# Altium schematic sheet PS_3_PMIC.SchDoc
size A3; SheetNumber: 18; SheetTotal: 19
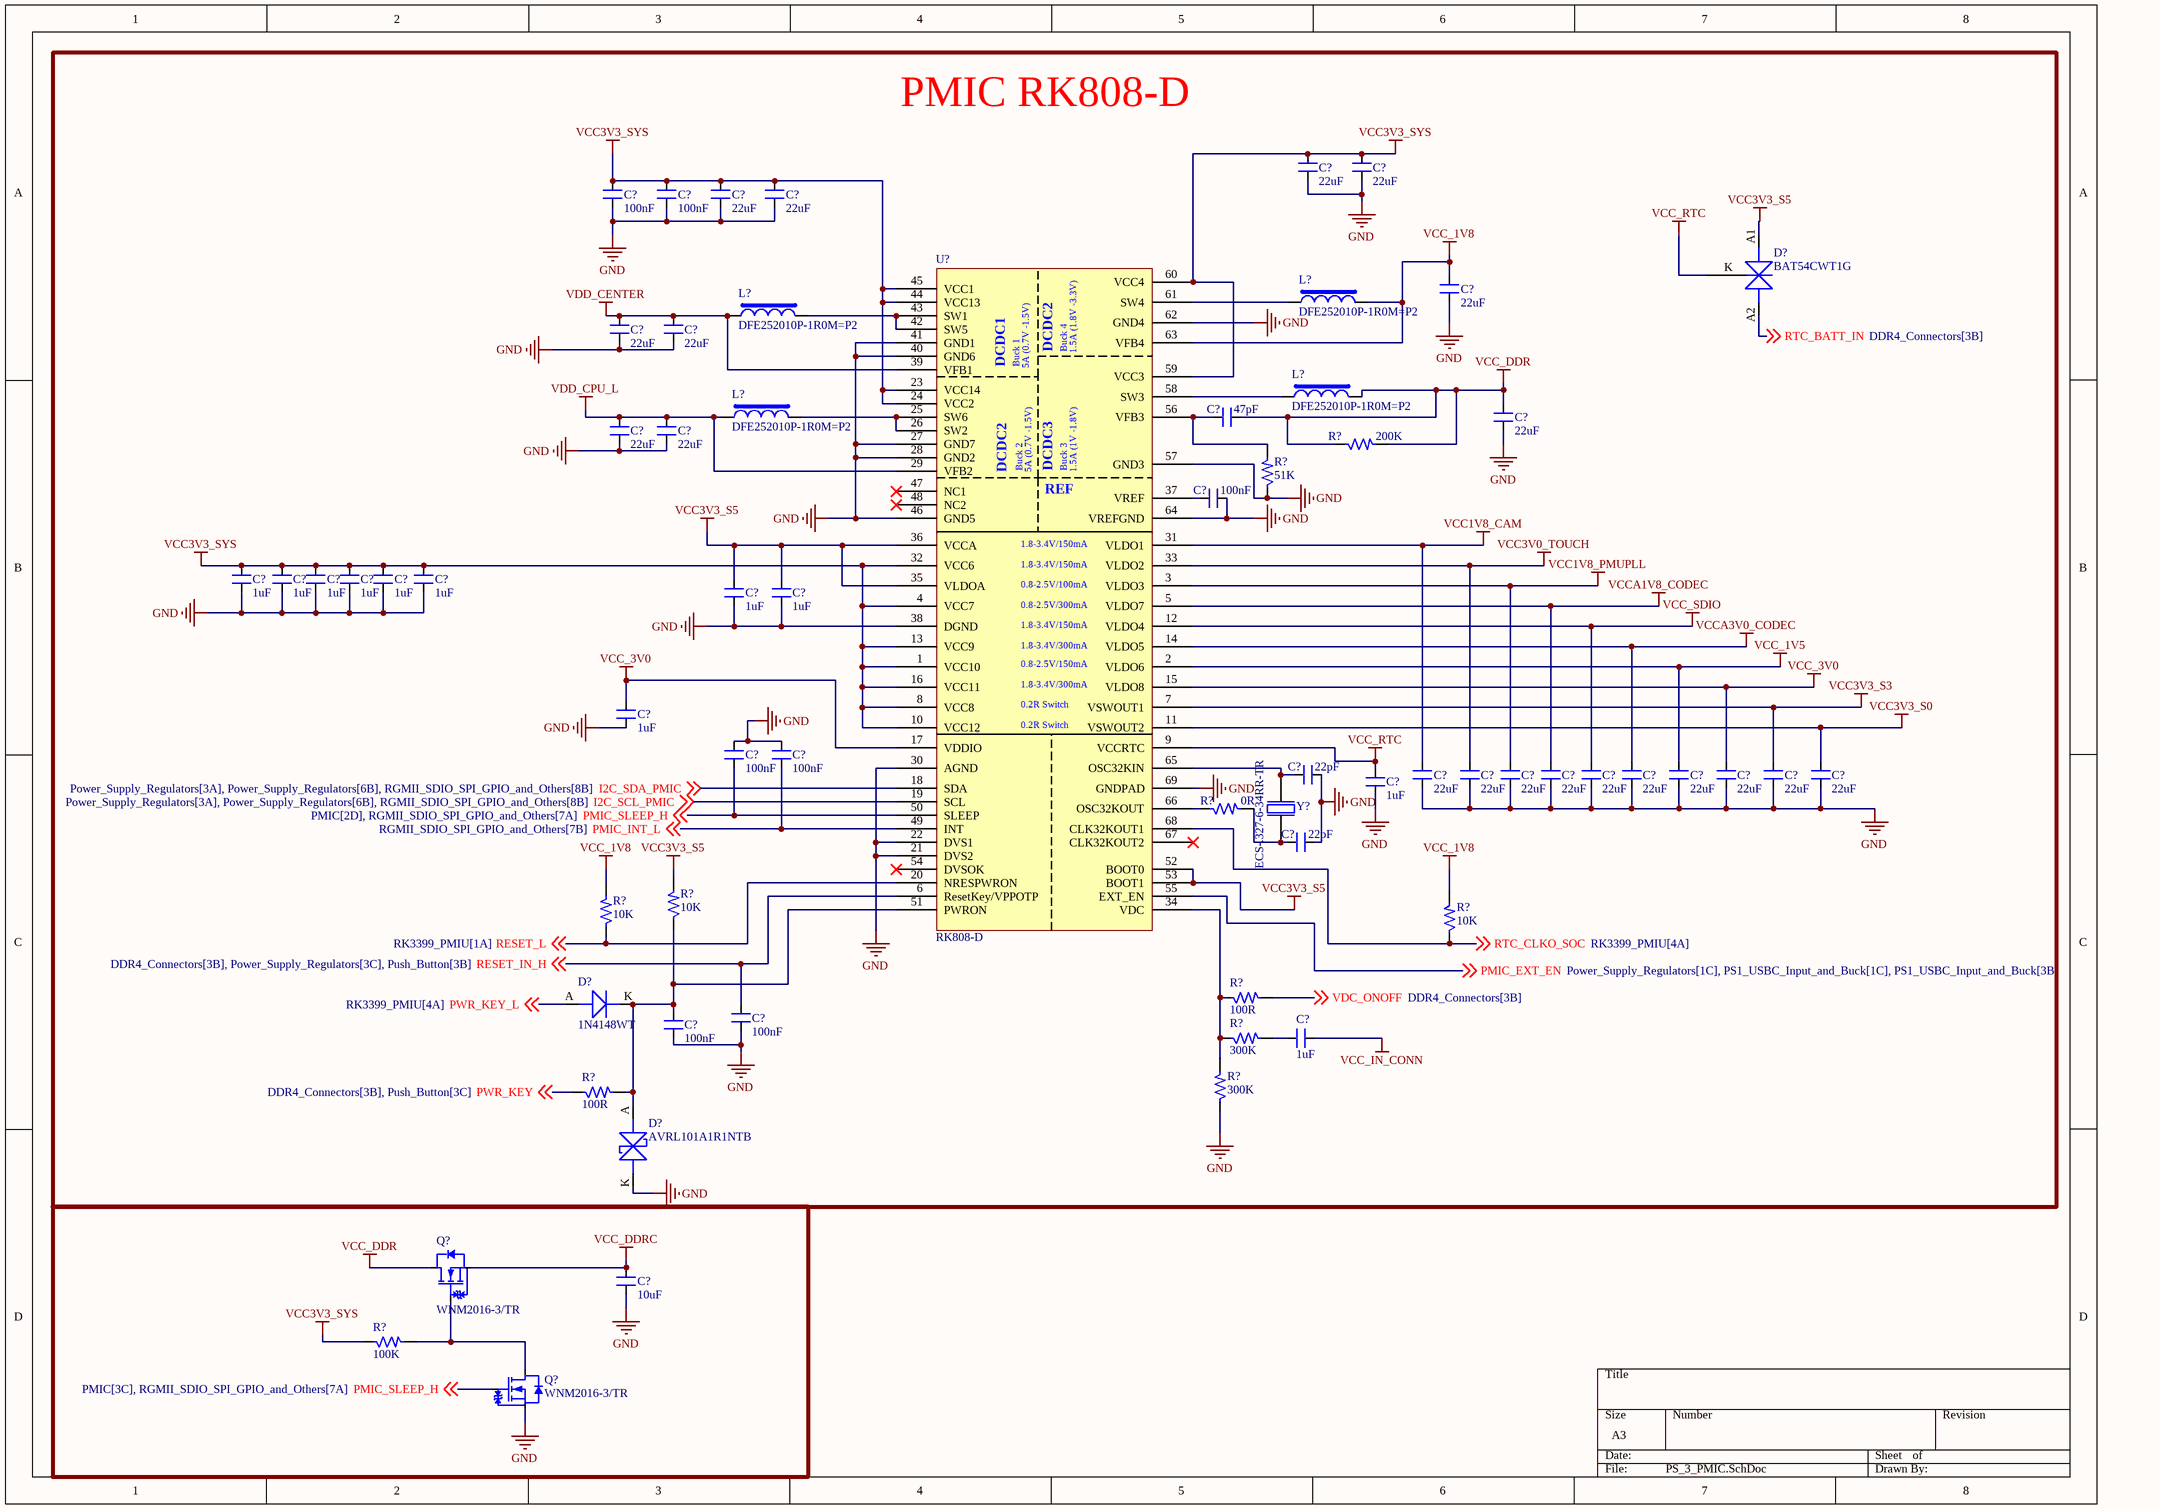
[diagram p0: PS_3_PMIC.SchDoc]

## Parts
(Parts that share a designator on the sheet are numbered #1, #2 ... from top to bottom, then left to right.)
C?#1  22uF  [CAP_0603]
C?#2  22uF  [CAP_0603]
C?#3  100nF  [CAP_0402]
C?#4  100nF  [CAP_0402]
C?#5  22uF  [CAP_0603]
C?#6  22uF  [CAP_0603]
C?#7  22uF  [CAP_0603]
C?#8  22uF  [CAP_0603]
C?#9  22uF  [CAP_0603]
C?#10  47pF  [CAP_0402]
C?#11  22uF  [CAP_0603]
C?#12  22uF  [CAP_0603]
C?#13  22uF  [CAP_0603]
C?#14  100nF  [CAP_0402]
C?#15  1uF  [CAP_0402]
C?#16  1uF  [CAP_0402]
C?#17  1uF  [CAP_0402]
C?#18  1uF  [CAP_0402]
C?#19  1uF  [CAP_0402]
C?#20  1uF  [CAP_0402]
C?#21  1uF  [CAP_0402]
C?#22  1uF  [CAP_0402]
C?#23  1uF  [CAP_0402]
C?#24  100nF  [CAP_0402]
C?#25  100nF  [CAP_0402]
C?#26  22pF  [CAP_0402]
C?#27  22uF  [CAP_0603]
C?#28  22uF  [CAP_0603]
C?#29  22uF  [CAP_0603]
C?#30  22uF  [CAP_0603]
C?#31  22uF  [CAP_0603]
C?#32  22uF  [CAP_0603]
C?#33  22uF  [CAP_0603]
C?#34  22uF  [CAP_0603]
C?#35  22uF  [CAP_0603]
C?#36  22uF  [CAP_0603]
C?#37  1uF  [CAP_0402]
C?#38  22pF  [CAP_0402]
C?#39  100nF  [CAP_0402]
C?#40  100nF  [CAP_0402]
C?#41  1uF  [CAP_0402]
C?#42  10uF  [CAP_0402]
D?#1  BAT54CWT1G  [DIO_SOT-323-3]
D?#2  1N4148WT  [DIO_SOD523]
D?#3  AVRL101A1R1NTB  [DIO_0402_SMD]
L?#1  DFE252010P-1R0M=P2  [IND_1008]
L?#2  DFE252010P-1R0M=P2  [IND_1008]
L?#3  DFE252010P-1R0M=P2  [IND_1008]
L?#4  DFE252010P-1R0M=P2  [IND_1008]
Q?#1  WNM2016-3/TR  [SOT 23-3]
Q?#2  WNM2016-3/TR  [SOT 23-3]
R?#1  200K  [RES_0402]
R?#2  51K  [RES_0402]
R?#3  0R  [RES_0402]
R?#4  10K  [RES_0402]
R?#5  10K  [RES_0402]
R?#6  10K  [RES_0402]
R?#7  100R  [RES_0402]
R?#8  300K  [RES_0402]
R?#9  100R  [RES_0402]
R?#10  300K  [RES_0402]
R?#11  100K  [RES_0402]
U?  RK808-D  [QFN68_13.7_220.4X220.4_SMD]
Y?  ECS-.327-6-34RR-TR  [XTAL_ECS-.327-6-34RR-TR]

## Blocks framed on the sheet
PMIC RK808-D: C?#1-C?#41 D?#1-D?#3 L?#1-L?#4 R?#1-R?#10 U? Y?

## Nets
GND: C?#1.1 C?#2.1 C?#3.1 C?#4.1 C?#5.1 C?#6.1 C?#7.1 C?#8.1 C?#9.1 C?#11.1 C?#12.1 C?#13.1 C?#14.2 C?#15.1 C?#16.1 C?#17.1 C?#18.1 C?#19.1 C?#20.1 C?#21.1 C?#22.1 C?#23.1 C?#24.2 C?#25.2 C?#26.2 C?#27.1 C?#28.1 C?#29.1 C?#30.1 C?#31.1 C?#32.1 C?#33.1 C?#34.1 C?#35.1 C?#36.1 C?#37.1 C?#38.2 C?#39.1 C?#40.1 C?#42.1 D?#3.K Q?#2.2(S) R?#2.1 R?#10.1 U?.21(DVS2) U?.22(DVS1) U?.27(GND7) U?.28(GND2) U?.30(AGND) U?.38(DGND) U?.40(GND6) U?.41(GND1) U?.46(GND5) U?.57(GND3) U?.62(GND4) U?.64(VREFGND) U?.69(GNDPAD)
VCC1V8_CAM: C?#27.2 U?.31(VLDO1)
VCC1V8_PMUPLL: C?#29.2 U?.3(VLDO3)
VCC3V0_TOUCH: C?#28.2 U?.33(VLDO2)
VCC3V3_S0: C?#36.2 U?.11(VSWOUT2)
VCC3V3_S3: C?#35.2 U?.7(VSWOUT1)
VCC3V3_S5: C?#21.2 C?#22.2 D?#1.A1 R?#4.2 U?.35(VLDOA) U?.36(VCCA) U?.52(BOOT0) U?.53(BOOT1)
VCC3V3_SYS: C?#1.2 C?#2.2 C?#3.2 C?#4.2 C?#5.2 C?#6.2 C?#15.2 C?#16.2 C?#17.2 C?#18.2 C?#19.2 C?#20.2 R?#11.1 U?.1(VCC10) U?.4(VCC7) U?.8(VCC8) U?.10(VCC12) U?.13(VCC9) U?.16(VCC11) U?.23(VCC14) U?.24(VCC2) U?.32(VCC6) U?.44(VCC13) U?.45(VCC1) U?.59(VCC3) U?.60(VCC4)
VCC_1V5: C?#33.2 U?.2(VLDO6)
VCC_1V8: C?#7.2 L?#1.2 R?#5.2 R?#6.2 U?.63(VFB4)
VCC_3V0: C?#23.2 C?#34.2 U?.15(VLDO8) U?.17(VDDIO)
VCC_DDR: C?#10.2 C?#11.2 L?#3.2 Q?#1.3(D) R?#1.1 R?#1.2
VCC_DDRC: C?#42.2 Q?#1.2(S)
VCC_IN_CONN: C?#41.2
VCC_RTC: C?#37.2 D?#1.K U?.9(VCCRTC)
VCC_SDIO: C?#31.2 U?.12(VLDO4)
VCCA1V8_CODEC: C?#30.2 U?.5(VLDO7)
VCCA3V0_CODEC: C?#32.2 U?.14(VLDO5)
VDD_CENTER: C?#8.2 C?#9.2 L?#2.1 U?.39(VFB1)
VDD_CPU_L: C?#12.2 C?#13.2 L?#4.1 U?.29(VFB2)
I2C_SCL_PMIC: U?.19(SCL) ; off-sheet I2C_SCL_PMIC
I2C_SDA_PMIC: U?.18(SDA) ; off-sheet I2C_SDA_PMIC
PMIC_EXT_EN: U?.55(EXT_EN) ; off-sheet PMIC_EXT_EN
PMIC_INT_L: C?#25.1 U?.49(INT) ; off-sheet PMIC_INT_L
PMIC_SLEEP_H: C?#24.1 Q?#2.1(G) U?.50(SLEEP) ; off-sheet PMIC_SLEEP_H
PWR_KEY: R?#9.1 ; off-sheet PWR_KEY
PWR_KEY_L: D?#2.A(ANODE) ; off-sheet PWR_KEY_L
RESET_IN_H: C?#39.2 U?.6(ResetKey/VPPOTP) ; off-sheet RESET_IN_H
RESET_L: R?#5.1 U?.20(NRESPWRON) ; off-sheet RESET_L
RTC_BATT_IN: D?#1.A2 ; off-sheet RTC_BATT_IN
RTC_CLKO_SOC: R?#6.1 U?.68(CLK32KOUT1) ; off-sheet RTC_CLKO_SOC
VDC_ONOFF: R?#7.2 ; off-sheet VDC_ONOFF
NetC?#10_1: C?#10.1 R?#2.2 U?.56(VFB3)
NetC?#14_1: C?#14.1 U?.37(VREF)
NetC?#26_1: C?#26.1 U?.65(OSC32KIN) Y?.2
NetC?#38_1: C?#38.1 R?#3.2 Y?.1
NetC?#40_2: C?#40.2 D?#2.K(CATHODE) D?#3.A R?#4.1 R?#9.2 U?.51(PWRON)
NetC?#41_1: C?#41.1 R?#8.2
NetL?#1_1: L?#1.1 U?.61(SW4)
NetL?#2_2: L?#2.2 U?.42(SW5) U?.43(SW1)
NetL?#3_1: L?#3.1 U?.58(SW3)
NetL?#4_2: L?#4.2 U?.25(SW6) U?.26(SW2)
NetQ?#1_1: Q?#1.1(G) Q?#2.3(D) R?#11.2
NetR?#3_1: R?#3.1 U?.66(OSC32KOUT)
NetR?#7_1: R?#7.1 R?#8.1 R?#10.2 U?.34(VDC)

Not connected (* = marked no-connect by the designer): U? 47(NC1)* 48(NC2)* 54(DVSOK)* 67(CLK32KOUT2)*

## Notes on the sheet
- (in symbol IC_RK808-D-QFN68) DCDC2; Buck 4; 1.5A (1.8V -3.3V); DCDC1; Buck 1; 5A (0.7V -1.5V); Buck 2; DCDC3; Buck 3; 1.5A (1V -1.8V); REF; 1.8-3.4V/150mA; 0.8-2.5V/100mA; 0.8-2.5V/300mA; 1.8-3.4V/300mA; 0.8-2.5V/150mA; 0.2R Switch

## Library data of the parts
C?#1 C?#2 C?#5-C?#9 C?#11-C?#13 C?#27-C?#36 = CAP_22uF-10V-20%-0603: 22µF ±20% 10V Ceramic Capacitor X5R 0603 (1608 Metric); Manufacturer: Murata Electronics; Manufacturer Part Number: GRM188R61A226ME15D; Case/Package: 0603; Supplier-1: Digikey
C?#3 C?#4 C?#14 C?#24 C?#25 C?#39 C?#40 = CAP_100nF-25V-10%-0402: 0.1µF ±10% 25V Ceramic Capacitor X7R 0402 (1005 Metric); Manufacturer: Walsin Technology Corporation; Manufacturer Part Number: 0402B104K250CT; Case/Package: 0402; Supplier-1: Digikey
C?#10 = CAP_47pF-10V-10%-0402: 47pF ±10% 10V Ceramic Capacitor C0G, NP0 0402 (1005 Metric); Manufacturer: KEMET; Manufacturer Part Number: C0402C470K8GAC7867; Case/Package: 0402; Supplier-1: Supplier-1
C?#15-C?#23 C?#37 C?#41 = CAP_1uF-16V-10%-0402: 1µF ±10% 16V Ceramic Capacitor X5R 0402 (1005 Metric); Manufacturer: Knowles Novacap; Manufacturer Part Number: 0402BW105K160YT; Case/Package: 0402; Supplier-1: Digikey
C?#26 C?#38 = CAP_22pF-10V-10%-0402: 22pF ±10% 10V Ceramic Capacitor C0G, NP0 0402 (1005 Metric); Manufacturer: KEMET; Manufacturer Part Number: C0402C220K8GACTU; Case/Package: 0402; Supplier-1: Digikey
C?#42 = CAP_10uF-10V-20%-0402: 10µF ±20% 10V Ceramic Capacitor X5R 0402 (1005 Metric); Manufacturer Part Number: CL05A106MP5NUNC; Manufacturer: Samsung Electro-Mechanics; Case/Package: 0402; Supplier-1: Digikey
D?#1 = DIO-S-A_30V-200mA-SOT-323: Diode Array 1 Pair Common Cathode Schottky 30V 200mA (DC) Surface Mount SC-70, SOT-323; Manufacturer: ON Semiconductor; Manufacturer Part Number: BAT54CWT1G; Case/Package: SOT323; Supplier-1: Digikey
D?#2 = DIO_75V-200mA-SOD-523F: Diode Standard 100V 300mA (DC) Surface Mount SOD-123; Manufacturer: FAIRCHILD; Manufacturer Part Number: 1N4148WT; Case/Package: SOD123; Supplier-1: SIRICOM
D?#3 = DIO-T_10V-39V-0402: 39V Varistor 1 Circuit Surface Mount, MLCV 0402 (1005 Metric); Manufacturer: TDK Corporation; Manufacturer Part Number: AVRL101A1R1NTB; Supplier-1: Digikey; Case/Package: 0402
L?#1-L?#4 = IND_1uH-3.8A-20%-1008: 1µH Shielded Wirewound Inductor 3.8A 54mOhm Max 1008 (2520 Metric); Manufacturer: Murata Electronics; Manufacturer Part Number: DFE252010P-1R0M=P2; Case/Package: 1008; Supplier-1: Digikey
Q?#1 Q?#2 = MOSFET-N_20V-2.9A-SOT-23: N Channel 20V 2.9A 1V @ 250uA 47mΩ @ 3.6A,4.5V 700mW SOT-23(SOT-23-3) MOSFET RoHS; Manufacturer: WILLSEMI(Will Semicon); Manufacturer Part Number: WNM2016-3/TR; Case/Package: SOT-23(SOT-23-3); Supplier-1: LCSC
R?#1 = RES_200K-0.1W-1%-0402: 200 kOhms ±1% 0.1W, 1/10W Chip Resistor 0402 (1005 Metric) Automotive AEC-Q200 Thick Film; Manufacturer: Panasonic Electronic Components; Manufacturer Part number: ERJ-2RKF2003X; Case/Package: 0402; Supplier-1: Digikey
R?#2 = RES_51K-0.1W-1%-0402: 51 kOhms ±1% 0.1W, 1/10W Chip Resistor 0402 (1005 Metric) Automotive AEC-Q200 Thick Film; Manufacturer: Panasonic Electronic Components; Manufacturer Part Number: ERJ-2RKF5102X; Case/Package: 0402; Supplier-1: Digikey
R?#3 = RES_0R-0.1W-1%-0402: 0 Ohms Jumper 0.1W, 1/10W Chip Resistor 0402 (1005 Metric) Automotive AEC-Q200 Thick Film; Manufacturer: Panasonic Electronic Components; Manufacturer Part Number: ERJ-2GE0R00X; Case/Package: 0402; Supplier-1: Digikey
R?#4-R?#6 = RES_10K-0.1W-1%-0402: 10 kOhms ±1% 0.1W, 1/10W Chip Resistor 0402 (1005 Metric) Anti-Sulfur Thin Film; Manufacturer: Vishay Beyschlag/Draloric/BC Components; Manufacturer Part Number: MCS04020C1002FE000; Case/Package: 0402; Supplier-1: Digikey
R?#7 R?#9 = RES_100R-0.1W-1%-0402: 100 Ohms ±1% 0.1W, 1/10W Chip Resistor 0402 (1005 Metric) Automotive AEC-Q200, Moisture Resistant Thick Film; Manufacturer: KOA Speer Electronics, Inc.; Manufacturer Part Number: RK73H1ETTP1000F; Case/Package: 0402; Supplier-1: Digikey
R?#8 R?#10 = RES_300K-0.1W-1%-0402: 300 kOhms ±1% 0.1W, 1/10W Chip Resistor 0402 (1005 Metric) Automotive AEC-Q200 Thick Film; Manufacturer: Panasonic Electronic Components; Manufacturer Part Number: ERJ-2RKF3003X; Case/Package: 0402; Supplier-1: Digikey
R?#11 = RES_100K-0.1W-1%-0402: 100 kOhms ±1% 0.1W, 1/10W Chip Resistor 0402 (1005 Metric) Anti-Sulfur Thin Film; Manufacturer: Vishay Beyschlag/Draloric/BC Components; Manufacturer Part Number: MCS04020C1003FE000; Case/Package: 0402; Supplier-1: Digikey
U? = IC_RK808-D-QFN68: The RK808 is a complete power supply solution for Portable systems.; Manufacturer: Rockchip; Manufacturer Part Number: RK808-D; Case/Package: QFN68; Supplier-1: Rockchip
Y? = XTAL_32.768Khz-22pF-SMD: 32.768kHz ±20ppm Crystal 12pF 80 kOhms 2-SMD, No Lead; Manufacturer: Ecliptek; Manufacturer Part Number: ECS-.327-6-34RR-TR; Case/Package: 0603; Supplier-1: Digikey